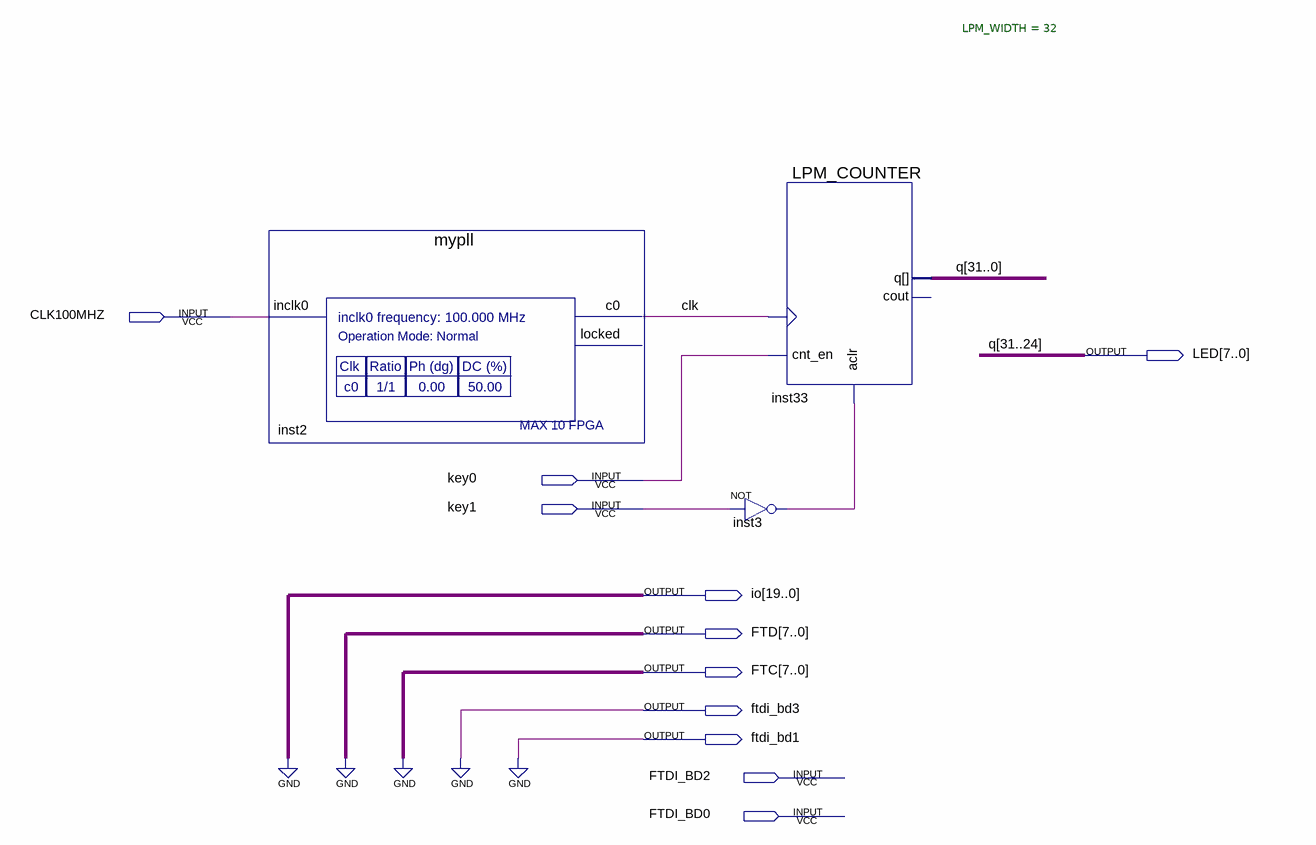
[diagram p0: schematic sheet]
// Quartus schematic max10.bdf as structural Verilog: 3 symbols, 11 pins
module max10 (
  input  CLK100MHZ,
  input  key0,
  input  key1,
  input  FTDI_BD2,
  input  FTDI_BD0,
  output [7:0] LED,
  output [19:0] io,
  output [7:0] FTD,
  output [7:0] FTC,
  output ftdi_bd3,
  output ftdi_bd1
);

  wire clk, inst3_out;
  wire [23:0] q;

  mypll inst2 (.inclk0(CLK100MHZ), .c0(clk));  // open: locked
  LPM_COUNTER #(.LPM_WIDTH(32)) inst33 (.aclr(inst3_out), .clock(clk), .cnt_en(key0), .q({LED, q}));  // open: cout
  not inst3 (inst3_out, key1);

  assign FTC = {8{1'b0}};
  assign FTD = {8{1'b0}};
  assign ftdi_bd1 = 1'b0;
  assign ftdi_bd3 = 1'b0;
  assign io = {20{1'b0}};

  // Other names for the same wires on the sheet: q[31:24] = LED
endmodule
